# EAGLE design x-bus-expander (EAGLE 9.6.2)
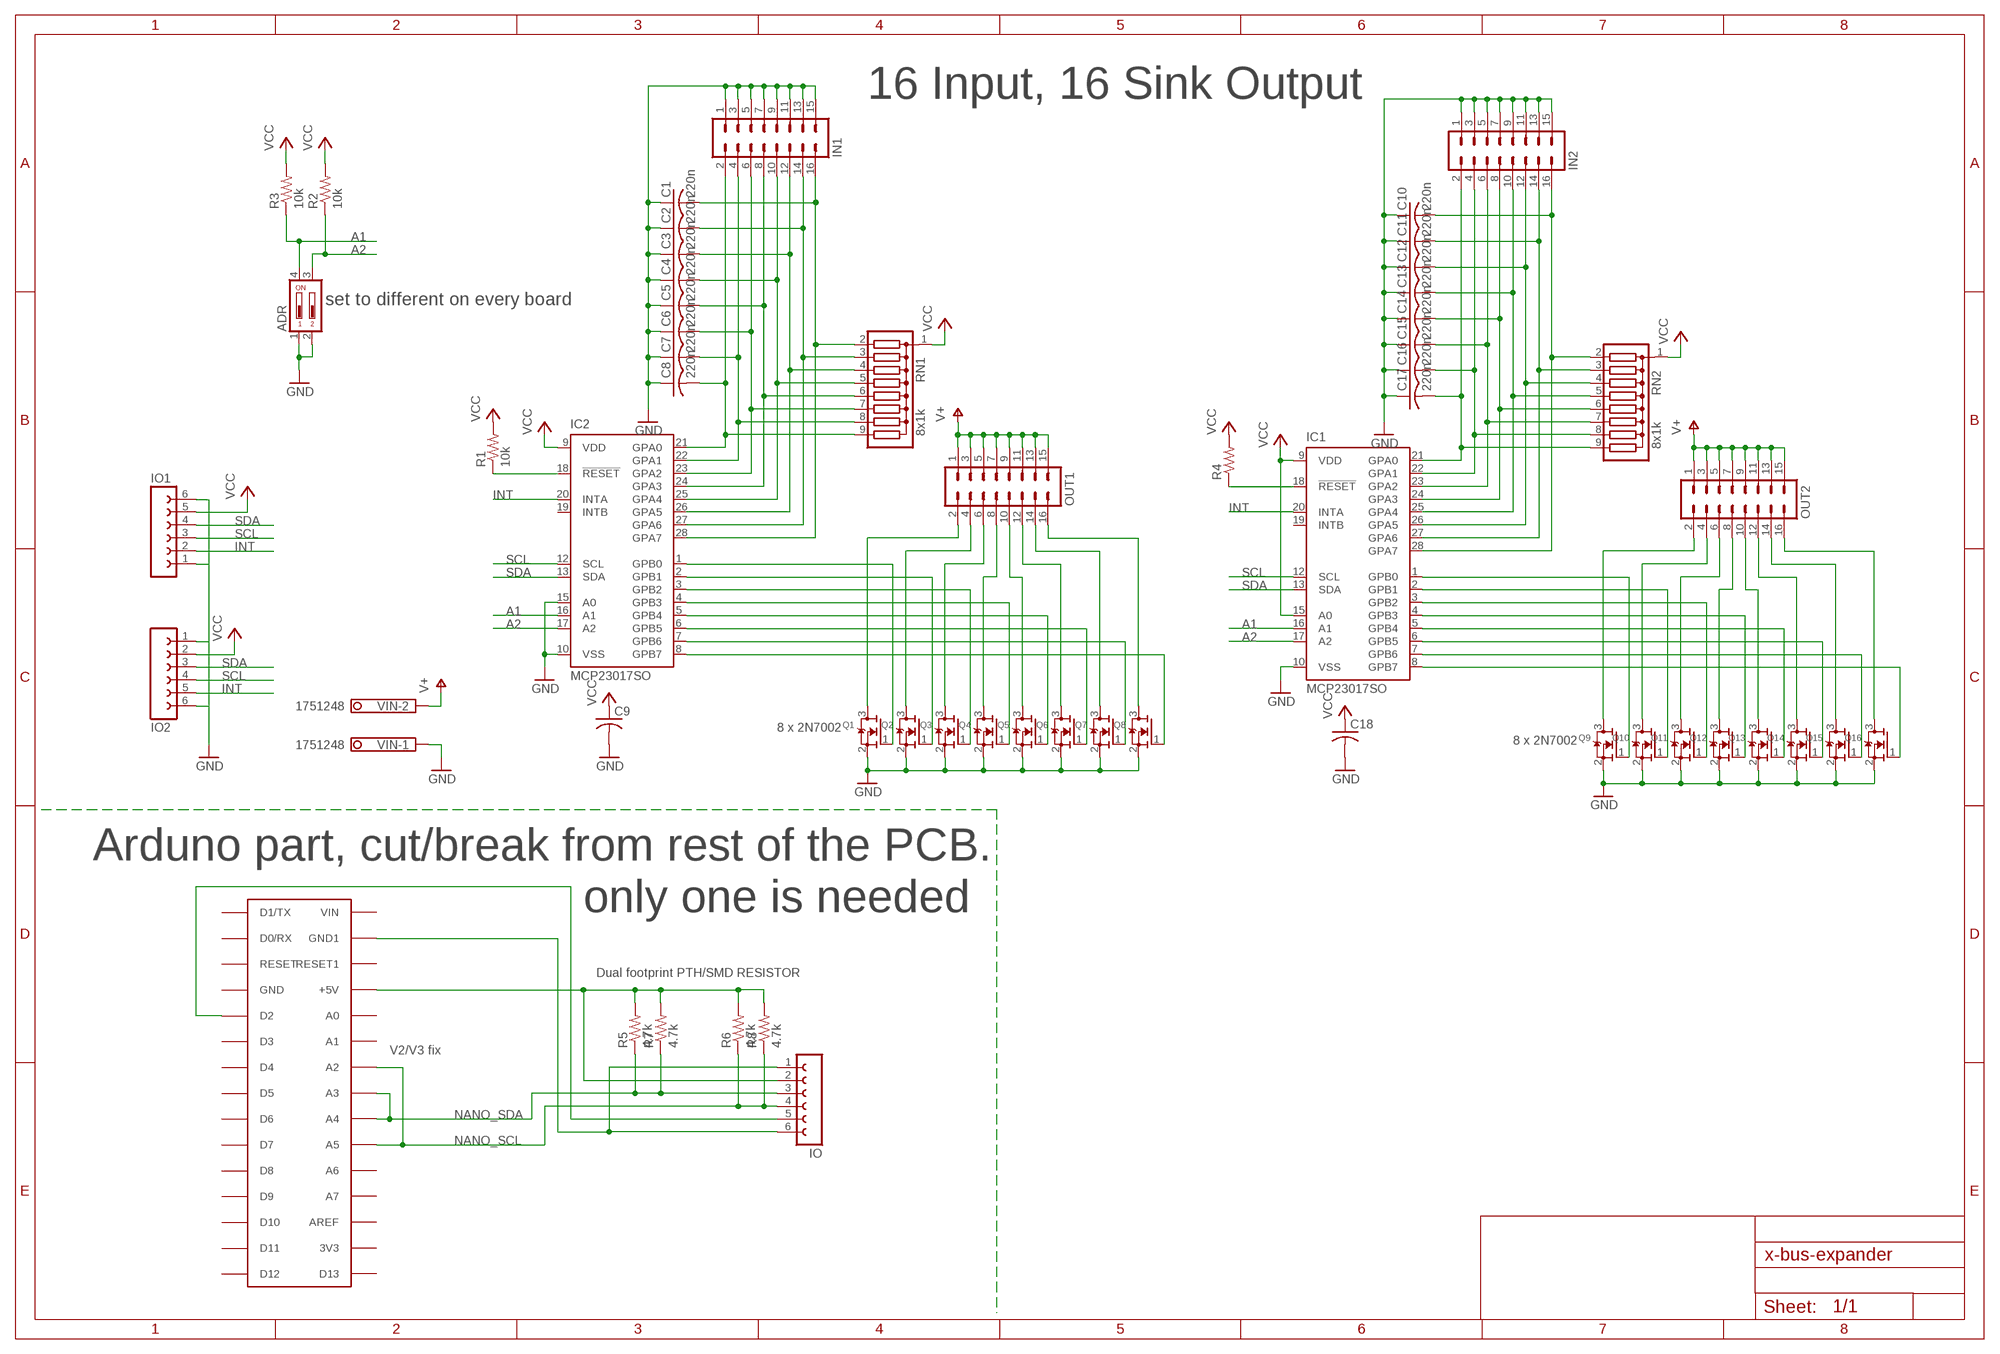
[diagram p0: schematic, sheet 1]

## Parts
ADR  DIP02YL  [DIP02YL]
C1  220n  C-USC0805  [C0805]
C2  220n  C-USC0805  [C0805]
C3  220n  C-USC0805  [C0805]
C4  220n  C-USC0805  [C0805]
C5  220n  C-USC0805  [C0805]
C6  220n  C-USC0805  [C0805]
C7  220n  C-USC0805  [C0805]
C8  220n  C-USC0805  [C0805]
C9  C-USC0805  [C0805]
C10  220n  C-USC0805  [C0805]
C11  220n  C-USC0805  [C0805]
C12  220n  C-USC0805  [C0805]
C13  220n  C-USC0805  [C0805]
C14  220n  C-USC0805  [C0805]
C15  220n  C-USC0805  [C0805]
C16  220n  C-USC0805  [C0805]
C17  220n  C-USC0805  [C0805]
C18  C-USC0805  [C0805]
IC1  MCP23017SO  [SO28W]
IC2  MCP23017SO  [SO28W]
IN1  ML16  [ML16]
IN2  ML16  [ML16]
IO  FE06W  [FE06W]
IO1  FE06W  [FE06W]
IO2  FE06W  [FE06W]
OUT1  ML16  [ML16]
OUT2  ML16  [ML16]
Q1  MOSFET-NREFLOW  [SOT23]
Q2  MOSFET-NREFLOW  [SOT23]
Q3  MOSFET-NREFLOW  [SOT23]
Q4  MOSFET-NREFLOW  [SOT23]
Q5  MOSFET-NREFLOW  [SOT23]
Q6  MOSFET-NREFLOW  [SOT23]
Q7  MOSFET-NREFLOW  [SOT23]
Q8  MOSFET-NREFLOW  [SOT23]
Q9  MOSFET-NREFLOW  [SOT23]
Q10  MOSFET-NREFLOW  [SOT23]
Q11  MOSFET-NREFLOW  [SOT23]
Q12  MOSFET-NREFLOW  [SOT23]
Q13  MOSFET-NREFLOW  [SOT23]
Q14  MOSFET-NREFLOW  [SOT23]
Q15  MOSFET-NREFLOW  [SOT23]
Q16  MOSFET-NREFLOW  [SOT23]
R1  10k  R-US_R0603  [R0603]
R2  10k  R-US_R0603  [R0603]
R3  10k  R-US_R0603  [R0603]
R4  R-US_R0603  [R0603]
R5  4.7k  R-US_0309/10  [0309/10]
R6  4.7k  R-US_0309/10  [0309/10]
R7  4.7k  R-US_R0603  [R0603]
R8  4.7k  R-US_R0603  [R0603]
RN1  8x1k  G08R  [SIL9]
RN2  8x1k  G08R  [SIL9]
U$1  ARDUINONANO  [PDIP-32]
VIN  1751248  [1751248]

## Nets
A1: ADR.4 IC1.16(A1) IC2.16(A1) R3.1
A2: ADR.3 IC1.17(A2) IC2.17(A2) R2.1
GND: ADR.1 ADR.2 C1.1 C2.1 C3.1 C4.1 C5.1 C6.1 C7.1 C8.1 C9.2 C10.1 C11.1 C12.1 C13.1 C14.1 C15.1 C16.1 C17.1 C18.2 IC1.10(VSS) IC2.10(VSS) IC2.15(A0) IN1.1 IN1.3 IN1.5 IN1.7 IN1.9 IN1.11 IN1.13 IN1.15 IN2.1 IN2.3 IN2.5 IN2.7 IN2.9 IN2.11 IN2.13 IN2.15 IO1.1 IO1.6 IO2.1 IO2.6 Q1.2(S) Q2.2(S) Q3.2(S) Q4.2(S) Q5.2(S) Q6.2(S) Q7.2(S) Q8.2(S) Q9.2(S) Q10.2(S) Q11.2(S) Q12.2(S) Q13.2(S) Q14.2(S) Q15.2(S) Q16.2(S) VIN.1
INT: IC1.20(INTA) IC2.20(INTA) IO1.2 IO2.5
N$1: OUT1.2 Q1.3(D)
N$2: OUT1.4 Q2.3(D)
N$3: OUT1.6 Q3.3(D)
N$4: OUT1.8 Q4.3(D)
N$5: OUT1.10 Q5.3(D)
N$6: OUT1.12 Q6.3(D)
N$7: OUT1.14 Q7.3(D)
N$8: OUT1.16 Q8.3(D)
N$9: IC2.1(GPB0) Q1.1(G)
N$10: IC2.2(GPB1) Q2.1(G)
N$11: IC2.3(GPB2) Q3.1(G)
N$12: IC2.4(GPB3) Q4.1(G)
N$14: IC2.5(GPB4) Q5.1(G)
N$15: IC2.6(GPB5) Q6.1(G)
N$16: IC2.7(GPB6) Q7.1(G)
N$17: IC2.8(GPB7) Q8.1(G)
N$19: C8.2 IC2.21(GPA0) IN1.2 RN1.9
N$20: C7.2 IC2.22(GPA1) IN1.4 RN1.8
N$21: C6.2 IC2.23(GPA2) IN1.6 RN1.7
N$22: C5.2 IC2.24(GPA3) IN1.8 RN1.6
N$23: C4.2 IC2.25(GPA4) IN1.10 RN1.5
N$24: C3.2 IC2.26(GPA5) IN1.12 RN1.4
N$25: C2.2 IC2.27(GPA6) IN1.14 RN1.3
N$26: C1.2 IC2.28(GPA7) IN1.16 RN1.2
N$27: IC2.18(!RESET) R1.1
N$28: OUT2.2 Q9.3(D)
N$29: OUT2.4 Q10.3(D)
N$30: OUT2.6 Q11.3(D)
N$31: OUT2.8 Q12.3(D)
N$32: OUT2.10 Q13.3(D)
N$33: OUT2.12 Q14.3(D)
N$34: OUT2.14 Q15.3(D)
N$35: OUT2.16 Q16.3(D)
N$36: IC1.1(GPB0) Q9.1(G)
N$37: IC1.2(GPB1) Q10.1(G)
N$38: IC1.3(GPB2) Q11.1(G)
N$39: IC1.4(GPB3) Q12.1(G)
N$41: IC1.5(GPB4) Q13.1(G)
N$42: IC1.6(GPB5) Q14.1(G)
N$43: IC1.7(GPB6) Q15.1(G)
N$44: IC1.8(GPB7) Q16.1(G)
N$46: C17.2 IC1.21(GPA0) IN2.2 RN2.9
N$47: C16.2 IC1.22(GPA1) IN2.4 RN2.8
N$48: C15.2 IC1.23(GPA2) IN2.6 RN2.7
N$49: C14.2 IC1.24(GPA3) IN2.8 RN2.6
N$50: C13.2 IC1.25(GPA4) IN2.10 RN2.5
N$51: C12.2 IC1.26(GPA5) IN2.12 RN2.4
N$52: C11.2 IC1.27(GPA6) IN2.14 RN2.3
N$53: C10.2 IC1.28(GPA7) IN2.16 RN2.2
N$54: IC1.18(!RESET) R4.1
N$55: IO.5 U$1.D2
N$56: IO.1 IO.6 U$1.GND1
N$57: IO.2 R5.2 R6.2 R7.2 R8.2 U$1.+5V
NANO_SCL: IO.4 R6.1 R8.1 U$1.A2 U$1.A5
NANO_SDA: IO.3 R5.1 R7.1 U$1.A3 U$1.A4
SCL: IC1.12(SCL) IC2.12(SCL) IO1.3 IO2.4
SDA: IC1.13(SDA) IC2.13(SDA) IO1.4 IO2.3
V+: OUT1.1 OUT1.3 OUT1.5 OUT1.7 OUT1.9 OUT1.11 OUT1.13 OUT1.15 OUT2.1 OUT2.3 OUT2.5 OUT2.7 OUT2.9 OUT2.11 OUT2.13 OUT2.15 VIN.2
VCC: C9.1 C18.1 IC1.9(VDD) IC1.15(A0) IC2.9(VDD) IO1.5 IO2.2 R1.2 R2.2 R3.2 R4.2 RN1.1 RN2.1
Unconnected: IC1.19(INTB) IC2.19(INTB) U$1.3V3 U$1.A0 U$1.A1 U$1.A6 U$1.A7 U$1.AREF U$1.D0/RX U$1.D1/TX U$1.D3 U$1.D4 U$1.D5 U$1.D6 U$1.D7 U$1.D8 U$1.D9 U$1.D10 U$1.D11 U$1.D12 U$1.D13 U$1.GND U$1.RESET U$1.RESET1 U$1.VIN

## Notes on the sheet
- 16 Input, 16 Sink Output
- set to different on every board
- 8 x 2N7002
- 8 x 2N7002
- Arduno part, cut/break from rest of the PCB.
- only one is needed
- Dual footprint PTH/SMD RESISTOR
- V2/V3 fix

## Library data of the parts
ADR = switch-dil:DIP02YL: DIL/CODE SWITCH; OC_FARNELL: unknown; OC_NEWARK: unknown
C1-C18 = rcl:C-US: CAPACITOR, American symbol
IC1 IC2 = adafruit:MCP23017: http://ww1.microchip.com/downloads/en/DeviceDoc/21952a.pdf Source: http://ww1.microchip.com/downloads/en/DeviceDoc/21952a.pdf
IN1 IN2 OUT1 OUT2 = con-harting-ml:ML16: HARTING; OC_FARNELL: unknown; OC_NEWARK: unknown
IO IO1 IO2 = con-lsta:FE06W: FEMALE HEADER; OC_FARNELL: unknown; OC_NEWARK: unknown
Q1-Q16 = adafruit:MOSFET-N: N-Channel Mosfet 2N7002E - 60V 260mA SOT23 [Digikey: 2N7002ET1GOSTR-ND] - REEL BSH103 - 30V 850mA SOT23 [Digikey: 568-5013-1-ND]
R1-R8 = rcl:R-US_: RESISTOR, American symbol
RN1 RN2 = resistor-sil:G08R: SIL RESISTOR; OC_FARNELL: unknown; OC_NEWARK: unknown
U$1 = jet-lib:ARDUINONANO
VIN = con-phoenix-350:1751248: MKDS 1/ 2-3,5 Printklemme Nennstrom: 10 A Bemessungsspannung: 160 V Raster: 3,5 mm Polzahl: 2 Montageart: Löten Anschlussart: Schraubanschluss Anschlussrichtung vom Leiter zur Platine: 0° Source: http://eshop.phoenixcontact.com .. 1751248.pdf; OC_FARNELL: unknown; OC_NEWARK: unknown

## Board
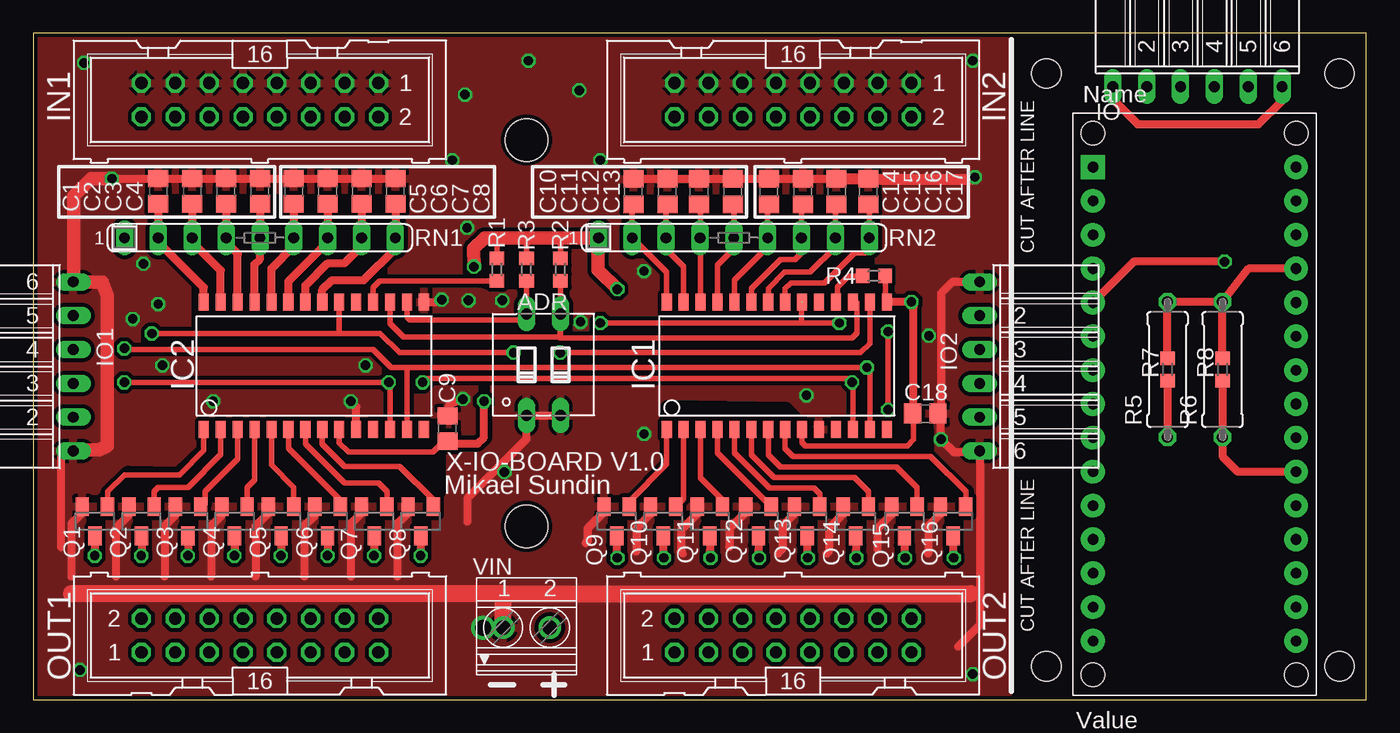
[diagram p1: board, top side]
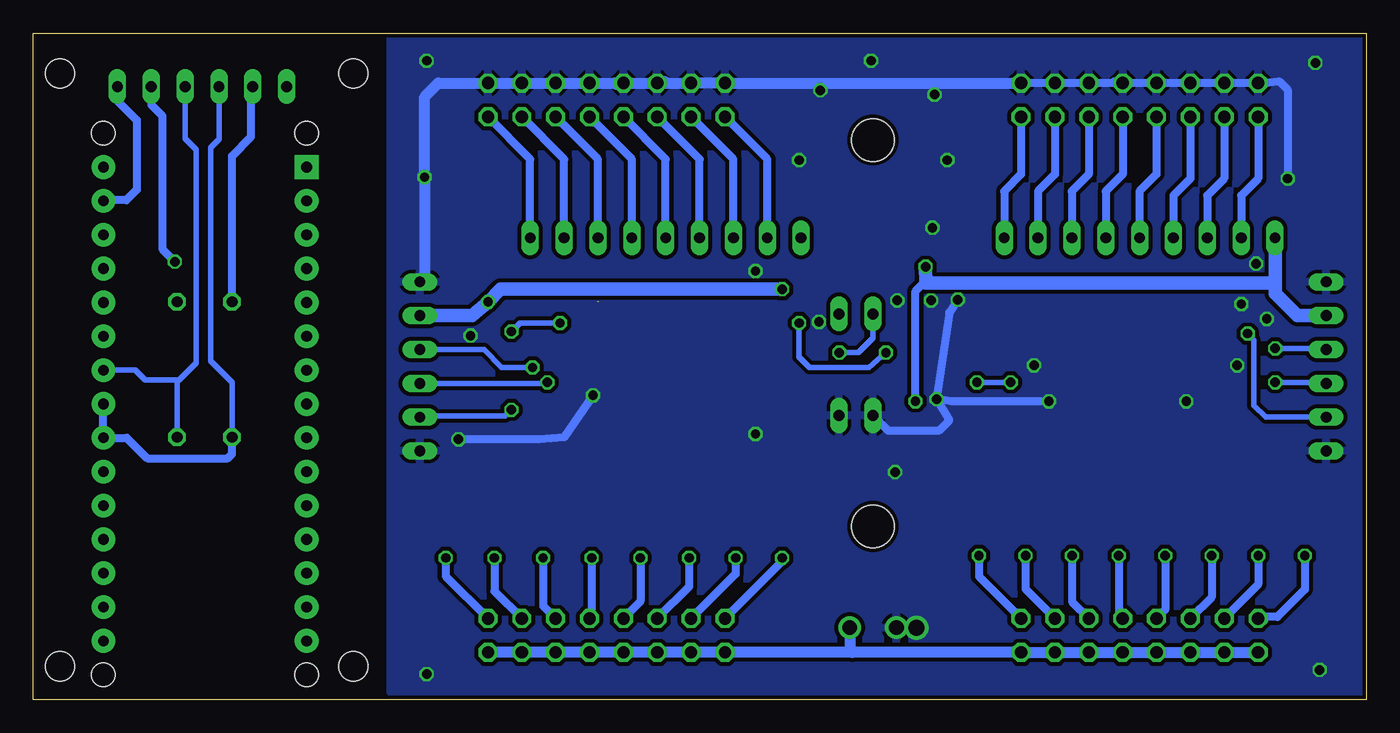
[diagram p2: board, bottom side, seen from below]

Size 100 x 50 mm. Coordinates in mm from the lower left corner, seen from the top.
Outline: 0,0 100,0 100,50 0,50 0,0
Copper layers (1*16): Top 0.035mm / dielectric 1.5mm / Bottom 0.035mm
Design rules "Elecrow_2-layer_eagle_rule": minimum track width 6mil, minimum drill 12mil, track to track 6mil, track to pad 6mil, pad to pad 6mil, via to via 6mil, smd to smd 0mil, copper to edge 10mil, drill to drill 10mil, minimum pad ring 10mil, minimum via ring 6mil, stop-mask expansion 2mil, vias tented up to drill 100mil, thermal gap 10mil
Holes 3.2 mm at 37,13 37,42
Holes 2.2 mm at 76,47 98,47 76,2.5 98,2.5
tRestrict: area 5.6,15.4 to 30.3,20.5; area 45.5,15.4 to 70,21.9; area 52.6,34 to 55.3,38.3; area 34,31.4 to 36.7,33.8; area 12.5,26.9 to 14,31.1

### Footprints (pad centres in the part's own frame; a part is rotated, then mirrored left to right if it is on the bottom)
DIP02YL = drill 0.813 long: 1 -1.27,-3.81; 2 1.27,-3.81; 3 1.27,3.81; 4 -1.27,3.81
C0805 = smd 1.3 x 1.5: 1 -0.95,0; 2 0.95,0
SO28W = smd 0.762 x 1.27: 1 -7.62,-4.78; 2 -6.35,-4.78; 3 -5.08,-4.78; 4 -3.81,-4.78; 5 -2.54,-4.78; 6 -1.27,-4.78; 7 0,-4.78; 8 1.27,-4.78; 9 2.54,-4.78; 10 3.81,-4.78; 11 5.08,-4.78; 12 6.35,-4.78; 13 7.62,-4.78; 14 8.89,-4.78; 15 8.89,4.78; 16 7.62,4.78; 17 6.35,4.78; 18 5.08,4.78; 19 3.81,4.78; 20 2.54,4.78; 21 1.27,4.78; 22 0,4.78; 23 -1.27,4.78; 24 -2.54,4.78; 25 -3.81,4.78; 26 -5.08,4.78; 27 -6.35,4.78; 28 -7.62,4.78
ML16 = drill 0.914 octagon: 1 -8.89,-1.27; 2 -8.89,1.27; 3 -6.35,-1.27; 4 -6.35,1.27; 5 -3.81,-1.27; 6 -3.81,1.27; 7 -1.27,-1.27; 8 -1.27,1.27; 9 1.27,-1.27; 10 1.27,1.27; 11 3.81,-1.27; 12 3.81,1.27; 13 6.35,-1.27; 14 6.35,1.27; 15 8.89,-1.27; 16 8.89,1.27
FE06W = drill 0.813 long: 1 -6.35,0; 2 -3.81,0; 3 -1.27,0; 4 1.27,0; 5 3.81,0; 6 6.35,0
SOT23 = smd 1 x 1.4: 1 -0.95,-1.1; 2 0.95,-1.1; 3 0,1.1
R0603 = smd 1 x 1.1: 1 -0.85,0; 2 0.85,0
0309/10 = drill 0.813 octagon: 1 -5.08,0; 2 5.08,0
SIL9 = drill 0.813 long: 1 -10.16,0; 2 -7.62,0; 3 -5.08,0; 4 -2.54,0; 5 0,0; 6 2.54,0; 7 5.08,0; 8 7.62,0; 9 10.16,0
PDIP-32 = drill 0.8 pad 1.778: 3V3 15.24,-35.56; +5V 15.24,-10.16; A0 15.24,-12.7; A1 15.24,-15.24; A2 15.24,-17.78; A3 15.24,-20.32; A4 15.24,-22.86; A5 15.24,-25.4; A6 15.24,-27.94; A7 15.24,-30.48; AREF 15.24,-33.02; D0/RX 0,-5.08; D2 0,-12.7; D3 0,-15.24; D4 0,-17.78; D5 0,-20.32; D6 0,-22.86; D7 0,-25.4; D8 0,-27.94; D9 0,-30.48; D10 0,-33.02; D11 0,-35.56; D12 0,-38.1; D13 15.24,-38.1; GND 0,-10.16; GND1 15.24,-5.08; RESET 0,-7.62; RESET1 15.24,-7.62; VIN 15.24,-2.54 | drill 0.8 pad 1.778 square: D1/TX 0,-2.54 | hole 1.778: 0,0; 0,-40.64; 15.24,-40.64; 15.24,0
1751248 = drill 1.1 pad 1.7: 1 -1.75,-0.1; 2 1.75,-0.1

### Placement (x,y rotation side)
ADR  38.27,25.13 0 top
C1  9.38,38.15 270 top
C2  11.92,38.15 270 top
C3  14.46,38.15 270 top
C4  17,38.15 270 top
C5  19.54,38.15 270 top
C6  22.08,38.15 270 top
C7  24.62,38.15 270 top
C8  27.16,38.15 270 top
C9  31.07,20.34 90 top
C10  45.02,38.12 270 top
C11  47.56,38.12 270 top
C12  49.95,38.12 270 top
C13  52.49,38.12 270 top
C14  55.19,38.12 270 top
C15  57.73,38.12 270 top
C16  60.27,38.12 270 top
C17  62.65,38.12 270 top
C18  66.92,21.46 0 top
IC1  55.14,25.05 0 top
IC2  20.41,25.05 0 top
IN1  17,45 180 top
IN2  57,45 180 top
IO  87.34,46 0 top
IO1  3,25 90 top
IO2  71,25 270 top
OUT1  17,4.81 0 top
OUT2  57,4.81 0 top
Q1  4.62,13.38 180 top
Q2  8.11,13.38 180 top
Q3  11.61,13.38 180 top
Q4  15.1,13.38 180 top
Q5  18.59,13.38 180 top
Q6  22.08,13.38 180 top
Q7  25.57,13.38 180 top
Q8  29.07,13.38 180 top
Q9  43.77,13.38 180 top
Q10  47.26,13.38 180 top
Q11  50.75,13.38 180 top
Q12  54.4,13.38 180 top
Q13  58.05,13.38 180 top
Q14  61.71,13.38 180 top
Q15  65.36,13.38 180 top
Q16  69.01,13.38 180 top
R1  34.78,32.27 90 top
R2  39.55,32.27 90 top
R3  37.01,32.27 90 top
R4  63.07,31.8 0 top
R5  85.09,24.77 90 top
R6  89.22,24.77 90 top
R7  85.09,24.77 90 top
R8  89.22,24.77 90 top
RN1  17,34.66 0 top
RN2  52.55,34.66 0 top
U$1  79.5,42.5 0 top
VIN  37,5.5 0 top

### Tracks (layer width: path | path; a pad name or v marks a point on that pad's centre or on a via)
A1  (via drill 0.7)
  Top 0.406: R3.1 ADR.4 36.69,28.46 28.27,28.46 28.03,28.7 IC2.16 | IC1.16 62.76,26.73 62.07,26.04 v39.53,26.04
  Bottom 0.406: v39.53,26.04 38.1,26.04 36.99,27.15 36.99,28.92 ADR.4
A2
  Top 0.406: ADR.3 R2.1 | IC2.17 26.76,28.23 27.8,27.19 39.55,27.19 39.55,28.26 | ADR.3 39.55,28.26 | 39.7,28.1 39.55,28.26 | IC1.17 61.44,30 61.59,29.84 61.59,30 61.81,29.79 61.81,27.52 61.44,27.15 39.53,27.15 39.53,28.89 39.59,28.89 ADR.3
GND  (via drill 0.7, 1.2)
  Top 0.61: C8.1 C7.1 C6.1 C5.1 C4.1 C3.1 C2.1 C1.1 v5.89,39.1 | Q8.2 28.12,13.99 27.3,13.18 27.3,9.21 | Q7.2 24.62,13.99 23.81,13.18 23.81,9.21 | Q6.2 21.13,13.83 20.32,13.02 20.32,9.21 | Q5.2 17.64,13.99 16.67,13.02 16.67,9.21 | Q4.2 14.15,13.83 13.34,13.02 13.34,9.21 | Q3.2 10.65,13.83 9.84,13.02 9.84,9.21 | Q2.2 7.16,13.83 6.19,12.86 6.19,9.21 | Q1.2 3.67,13.99 2.86,13.18 2.86,9.21 | Q10.2 46.31,13.93 45.24,12.86 45.24,11.11 | Q9.2 42.82,14.08 41.59,12.86 41.59,11.91 41.43,11.75 | Q11.2 49.8,13.93 48.58,12.7 48.58,11.11 48.74,10.95 | Q12.2 53.45,14.08 52.23,12.86 52.23,11.43 | Q13.2 57.1,13.93 56.2,13.02 56.2,11.27 55.88,10.95 | 60.76,13.93 59.69,12.86 59.69,11.11 59.53,10.95 | Q15.2 64.41,13.93 63.34,12.86 63.34,11.27 | Q16.2 68.06,13.93 67.15,13.02 67.15,10.95 | C16.1 C15.1 C14.1 C13.1 C12.1 C11.1 C10.1 | 69.37,3.97 71,5.59 IO2.6 70.92,18.57 69.06,18.57 v68.1,19.53 68.1,21.59 | IO2.1 68.97,31.35 68.1,30.48 68.1,21.59 | C18.2 67.86,21.84 68.1,21.59 | C9.2 31.23,22.18 v32.23,22.54 | IC2.15 30.14,29.83 v30.64,30 | 32.54,13.34 32.54,15.08 37.01,19.54 ADR.1 ADR.2 | IO1.1 2.46,18.65 2.06,18.26 2.06,11.43 | IC2.10 24.22,21.97 v23.81,22.38
  Top 0.813: v70.64,39.21 70.5,39.07 C17.1 C16.1
  Top 1.016: IO1.1 2.92,18.73 4.92,18.73 5.56,19.05 5.56,30.32 5.16,31.35 IO1.6 3.02,31.37 3.02,37.78 4.33,39.1 v5.89,39.1
  Top 1.27: 35.24,7.94 2.86,7.94 | VIN.1 35.25,7.93 35.24,7.94 | 35.24,7.94 70.33,7.94
  Bottom 0.61: IN1.7 IN1.9 IN1.11 IN1.13 IN1.15 6.53,46.4 5.89,45.77 v5.89,39.1 | 18.91,46.4 IN1.7 | IN1.7 IN1.5 IN1.3 IN1.1 | v58,22.84 60.17,19.68 62.07,19.53 v68.1,19.53 | v32.23,22.54 31.27,20.95 32.07,20.16 35.85,20.16 ADR.1 | v30.64,30 31.27,29.05 v32.23,22.54 | v23.81,22.38 31.11,22.38 v32.23,22.54
  Bottom 0.813: IN2.3 IN2.5 IN2.7 56.43,46.27 56.36,46.2 55.8,46.2 IN2.9 IN2.11 | IN2.11 52.63,46.27 52.55,46.35 53.1,46.35 IN2.11 | IN2.11 IN2.13 IN2.15 IN1.1 | IO2.1 70.64,31.71 v70.64,39.21 70.64,45.24 69.62,46.27 63.43,46.27 63.34,46.35
  other vias: 3.81,47.78 37.15,47.94 40.96,45.72 32.38,45.4 32.54,35.4 42.55,40.48 70.48,47.94 70.48,1.91 3.49,2.22 9.37,29.69 7.46,28.57 33.76,5.38 32.65,29.95 35.19,29.95 45.82,32.15 67.19,27.3 45.82,19.93 35.34,17.07 8.26,32.7 13.49,22.38 24.92,25.08 9.68,25.08 31.43,40.48 41.05,28.34
  pour Top (isolate 0.305): 0.32,50.01 73.18,50.16 73.18,0.48 0.32,0.32
  pour Bottom (isolate 0.305): -0.32,0.48 73.18,0.48 73.18,49.85 -0.32,49.85
INT  (via drill 0.7)  (1 unrouted)
  Top 0.406: 57.63,28.26 57.63,29.86 | 22.95,27.56 23.02,27.46 26.04,27.46 27.46,26.04 v36.04,26.04 | IC2.20 22.95,27.56 | v60.48,28.26 57.63,28.26 | 57.63,28.26 v42.55,28.26 | v8.89,27.46 22.95,27.46 22.95,27.56 | v64.14,27.62 v64.14,21.75
  Bottom 0.406: v42.55,28.26 42.55,25.72 41.75,24.92 37.31,24.92 v36.04,26.04 | IO1.2 7.54,21.19 8.41,22.07 8.41,26.99 v8.89,27.46 | v60.48,28.26 63.5,28.26 v64.14,27.62 | v64.14,21.75 64.61,21.27 70.92,21.27 IO2.5
N$1  (via drill 0.7)
  Top 0.61: Q1.3 4.62,10.81 v4.6,10.79
  Bottom 0.61: v4.6,10.79 4.6,8.26 6.67,6.19 8,6.19 OUT1.2
N$2  (via drill 0.7)
  Top 0.61: Q2.3 8.11,10.81 v8.1,10.79
  Bottom 0.61: v8.1,10.79 8.1,8.63 OUT1.4
N$3  (via drill 0.7)
  Top 0.61: Q3.3 11.61,10.81 v11.59,10.79
  Bottom 0.61: v11.59,10.79 11.59,7.68 OUT1.6
N$4  (via drill 0.7)
  Top 0.61: Q4.3 15.1,10.81 v15.08,10.79
  Bottom 0.61: v15.08,10.79 15.08,6.73 OUT1.8
N$5  (via drill 0.7)
  Top 0.61: Q5.3 18.59,10.94 v18.57,10.79
  Bottom 0.61: v18.57,10.79 18.57,6.38 OUT1.10
N$6  (via drill 0.7)
  Top 0.61: Q6.3 22.08,10.81 v22.07,10.79
  Bottom 0.61: v22.07,10.79 22.07,7.34 OUT1.12
N$7  (via drill 0.7)
  Top 0.61: Q7.3 25.57,10.81 v25.56,10.79
  Bottom 0.61: v25.56,10.79 25.56,8.29 OUT1.14
N$8  (via drill 0.7)
  Top 0.61: Q8.3 29.07,10.81 v29.05,10.79
  Bottom 0.61: v29.05,10.79 29.05,9.24 OUT1.16
N$9
  Top 0.406: IC2.1 12.79,18.7 10.97,16.88 6.84,16.88 5.57,15.61 5.57,14.61 | 5.57,14.61 Q1.1 | Q1.1 5.57,14.6 5.57,14.61
N$10
  Top 0.406: IC2.2 14.06,18.38 11.61,15.92 9.38,15.92 9.06,15.61 Q2.1
N$11
  Top 0.406: IC2.3 15.33,18.06 12.88,15.61 12.88,14.65 12.71,14.48 Q3.1
N$12
  Top 0.406: IC2.4 16.6,16.48 16.05,15.92 Q4.1
N$14
  Top 0.406: IC2.5 17.87,17.59 19.54,15.92 Q5.1
N$15
  Top 0.406: IC2.6 19.14,18.86 23.04,14.97 Q6.1
N$16
  Top 0.406: IC2.7 20.41,19.18 23.35,16.24 25.89,16.24 26.53,15.61 Q7.1
N$17
  Top 0.406: IC2.8 21.68,19.18 23.35,17.51 27.48,17.51 30.02,14.97 Q8.1
N$19
  Top 0.61: IC2.21 21.68,30.76 22.4,31.48 24.78,31.48 27.16,33.86 27.16,34.34 RN1.9 27.16,34.34 C8.2
  Bottom 0.61: IN1.2 25.89,39.42 27.16,38.15 27.16,34.34 RN1.9
N$20
  Top 0.61: IC2.22 20.41,31.08 22.08,32.75 23.35,32.75 24.62,34.02 24.62,34.34 RN1.8 24.62,34.34 C7.2
  Bottom 0.61: IN1.4 23.35,39.42 24.62,38.15 24.62,34.34 RN1.8
N$21
  Top 0.61: IC2.23 19.14,31.4 22.08,34.34 RN1.7 22.08,34.34 C6.2
  Bottom 0.61: IN1.6 20.81,39.42 22.08,38.15 22.08,34.34 RN1.7
N$22
  Top 0.61: IC2.24 17.87,32.35 19.54,34.02 19.54,34.34 RN1.6 19.54,34.34 C5.2
  Bottom 0.61: IN1.8 18.27,39.42 19.54,38.15 19.54,34.34 RN1.6
N$23
  Top 0.61: IC2.25 16.6,32.67 17,33.07 17,34.34 16.92,34.26 RN1.5 17,34.34 C4.2
  Bottom 0.61: IN1.10 15.73,39.42 17,38.15 17,34.34 RN1.5
N$24
  Top 0.61: IC2.26 15.33,33.47 14.46,34.34 RN1.4 14.46,34.34 C3.2
  Bottom 0.61: IN1.12 13.19,39.1 14.46,37.83 14.46,34.34 RN1.4
N$25
  Top 0.61: IC2.27 14.06,32.2 11.92,34.34 RN1.3 11.92,34.34 C2.2
  Bottom 0.61: IN1.14 10.65,39.1 11.92,37.83 11.92,34.34 RN1.3
N$26
  Top 0.61: IC2.28 12.79,30.93 9.38,34.34 RN1.2 9.38,34.34 C1.2
  Bottom 0.61: IN1.16 8.11,39.1 9.38,37.83 9.38,34.34 RN1.2
N$27
  Top 0.406: R1.1 26,31.42 25.49,30.92 IC2.18
N$28  (via drill 0.7)
  Top 0.61: Q9.3 43.77,11.16 v43.81,10.64
  Bottom 0.61: v43.81,10.64 43.81,10.38 OUT2.2
N$29  (via drill 0.7)
  Top 0.61: Q10.3 47.26,11.16 v47.31,10.64
  Bottom 0.61: v47.31,10.64 47.31,9.42 OUT2.4
N$30  (via drill 0.7)
  Top 0.61: Q11.3 50.75,11.16 v50.8,10.64
  Bottom 0.61: v50.8,10.64 50.8,8.47 OUT2.6
N$31  (via drill 0.7)
  Top 0.61: Q12.3 54.4,11.16 v54.45,10.64
  Bottom 0.61: v54.45,10.64 54.45,7.36 OUT2.8
N$32  (via drill 0.7)
  Top 0.61: Q13.3 58.05,11.16 v58.1,10.64
  Bottom 0.61: v58.1,10.64 58.1,6.25 OUT2.10
N$33  (via drill 0.7)
  Top 0.61: Q14.3 61.71,11.16 v61.75,10.64
  Bottom 0.61: v61.75,10.64 61.75,7.02 OUT2.12
N$34  (via drill 0.7)
  Top 0.61: Q15.3 65.36,11 v65.41,10.64
  Bottom 0.61: v65.41,10.64 65.41,8.13 OUT2.14
N$35  (via drill 0.7)
  Top 0.61: 69.17,10.68 v69.06,10.64 69.01,10.68 Q16.3
  Bottom 0.61: v69.06,10.64 69.06,9.25 OUT2.16
N$36
  Top 0.406: 44.77,14.92 44.77,14.53 Q9.1 44.72,14.87 47.52,17.68 IC1.1
N$37
  Top 0.406: IC1.2 48.79,15.06 Q10.1
N$38
  Top 0.406: Q11.1 51.7,14.97 50.06,16.61 IC1.3
N$39
  Top 0.406: IC1.4 51.33,18.5 Q12.1
N$41
  Top 0.406: IC1.5 52.6,18.52 55.24,15.88 58.58,15.88 59.01,15.45 Q13.1
N$42
  Top 0.406: IC1.6 53.87,18.36 55.56,16.67 61.59,16.67 62.66,15.61 Q14.1
N$43
  Top 0.406: IC1.7 55.14,18.36 56.04,17.46 64.77,17.46 66.31,15.93 Q15.1
N$44
  Top 0.406: IC1.8 56.41,18.84 56.99,18.26 67.31,18.26 69.96,15.61 Q16.1
N$46
  Top 0.406: IC1.21 56.41,30.85 56.83,31.27 59.37,31.27 61.59,33.5 62.39,33.5 62.71,33.81 62.71,34.65 RN2.9 62.72,37.1 C17.2
  Bottom 0.61: RN2.9 62.72,40.55 IN2.2
N$47
  Top 0.406: IC1.22 55.14,30.85 56.36,32.07 58.26,32.07 60.17,33.97 60.17,34.65 RN2.8 60.17,37.08 C16.2
  Bottom 0.61: RN2.8 60.17,40.55 IN2.4
N$48
  Top 0.406: IC1.23 53.87,30.85 56.04,33.02 57.15,33.02 57.63,33.5 57.63,34.65 RN2.7 57.63,37.08 C15.2
  Bottom 0.61: RN2.7 57.63,40.55 IN2.6
N$49
  Top 0.406: IC1.24 52.6,31.49 55.09,33.97 55.09,34.61 | 55.09,34.61 55.09,37.07 C14.2 | RN2.6 55.09,34.62 55.09,34.61
  Bottom 0.61: RN2.6 55.09,40.55 IN2.8
N$50
  Top 0.406: IC1.25 51.33,32.6 52.55,33.81 52.55,34.65 RN2.5 52.55,37.1 C13.2
  Bottom 0.61: RN2.5 52.55,40.55 IN2.10
N$51
  Top 0.406: IC1.26 50.06,34.77 | 50.06,34.77 50.06,37.05 C12.2 | RN2.4 50.02,34.72 50.06,34.77
  Bottom 0.61: RN2.4 50.02,40.55 IN2.12
N$52
  Top 0.406: IC1.27 48.79,32.49 47.47,33.81 47.47,34.61 | 47.47,34.61 47.47,37.07 C11.2 | RN2.3 47.48,34.62 47.47,34.61
  Bottom 0.61: RN2.3 47.48,40.55 IN2.14
N$53
  Top 0.406: IC1.28 47.52,32.07 RN2.2 44.94,37.08 C10.2
  Bottom 0.61: RN2.2 44.94,40.55 IN2.16
N$54
  Top 0.406: R4.1 61.17,31.8 60.33,30.96 60.33,29.93 IC1.18
N$55  (via drill 0.7)
  Top 0.61: 79.61,29.69 U$1.D2 82.56,32.86 v89.38,32.86
  Bottom 0.61: IO.5 91.15,44.64 90.33,43.81 90.33,33.81 v89.38,32.86
N$56
  Top 0.61: IO.1 80.99,45.06 82.87,43.18 91.92,43.18 93.69,44.95 IO.6
  Bottom 0.61: IO.6 93.69,44.95 92.23,43.5 92.23,38.26 93.03,37.47 94.69,37.47 U$1.GND1
N$57
  Top 0.61: U$1.+5V 91.17,32.34 R6.2 | R6.2 R5.2 R7.2 | R8.2 R6.2
  Bottom 0.61: IO.2 83.66,45.97 83.66,42.23 85.09,40.8 R5.2
NANO_SCL
  Top 0.61: U$1.A5 90.37,17.1 89.22,18.26 R6.1 R8.1
  Bottom 0.406: IO.4 88.61,42.1 87.79,41.27 87.79,25.24 89.06,23.97 89.22,23.97 R8.1 | U$1.A2 92.35,24.72 91.6,23.97 89.27,23.97 R8.1 | R8.1 R6.1
NANO_SDA
  Top 0.61: R7.1 R5.1
  Bottom 0.406: R5.1 85.09,23.81 86.68,25.4 86.68,41.43 86.04,42.07 86.04,45.97 IO.3
  Bottom 0.61: 86.36,45.87 IO.3 | R5.1 85.09,18.41 85.41,18.1 91.44,18.1 92.98,19.64 U$1.A4 U$1.A3
SCL  (via drill 0.7)
  Top 0.406: IC2.12 26.76,23.75 v26.67,23.81 v6.83,23.81 | IC1.12 61.49,23.28 v61.44,23.81 61.42,23.81 61.16,24.08 29.51,24.08 29.23,23.8 v29.21,23.81 | 3.08,23.81 IO1.3
  Bottom 0.406: v29.21,23.81 v26.67,23.81 | IO2.4 61.36,23.73 v61.44,23.81 | v6.83,23.81 3.08,23.81 IO1.3
SDA  (via drill 0.7)
  Top 0.406: IC1.13 62.76,24.71 v62.55,24.92 27.94,24.92 | 27.94,24.92 26.83,24.92 25.48,26.27 7.07,26.27 v6.83,26.35 | IC2.13 28.03,24.83 27.94,24.92
  Bottom 0.406: v62.55,24.92 64.85,24.92 66.2,26.27 IO2.3 | v6.83,26.35 3.08,26.35 IO1.4
V+
  Bottom 0.813: 38.58,3.54 OUT1.15 OUT1.13 OUT1.11 OUT1.9 OUT1.7 OUT1.5 OUT1.3 OUT1.1 | 38.58,3.54 OUT2.1 OUT2.3 OUT2.5 OUT2.7 OUT2.9 OUT2.11 OUT2.13 OUT2.15 | VIN.2 38.75,3.71 38.58,3.54
VCC  (via drill 0.7)
  Top 0.406: IC2.9 22.95,19.27 23.65,18.57 30,18.57 30.64,19.21 31.75,19.21 | 31.21,19.37 C9.1 | 66.04,21.43 65.88,21.59 66.07,21.27 C18.1 66.04,21.4 66.04,19.53 65.56,19.05 57.94,19.05 57.68,19.31 IC1.9 | R1.2 34.78,34.63 34.77,34.65 | R3.2 37.01,34.63 36.99,34.65 | R2.2 39.55,34.63 39.53,34.65 | R4.2 63.92,29.94 IC1.15
  Top 0.61: 34.77,33.14 R1.2 | 64.03,29.9 IC1.15 64.05,29.84 v65.88,29.84 66.04,29.53 66.04,21.43 | 31.21,19.37 31.75,19.21 33.34,19.21 33.81,19.68 v33.81,22.38
  Top 1.016: 42.39,34.65 39.53,34.65 36.99,34.65 34.77,34.65 33.86,34.65 33.05,33.83 v33.05,32.49 | 42.39,34.65 42.39,32.23 v43.81,30.8 | 42.39,34.65 RN2.1
  Bottom 0.61: v33.81,22.38 33.81,30.64 33.02,31.43 33.1,32.49 v33.05,32.49
  Bottom 1.016: IO2.2 67.08,28.81 v65.88,29.84 64.93,30.8 v43.81,30.8 | IO1.5 5.16,28.81 6.83,30.48 6.83,31.27 | 6.83,31.27 6.83,34.64 RN1.1 | v33.05,32.49 33.01,31.27 6.83,31.27

### Text on the board
tPlace: CUT AFTER LINE | X-IO-BOARD V1.0 | Mikael Sundin | CUT AFTER LINE